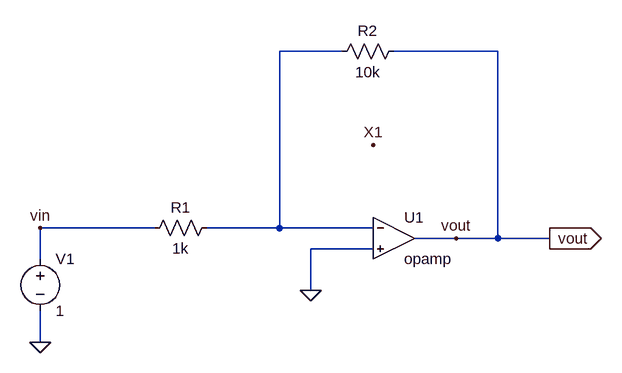
[diagram p0: schematic Practice Work 3.asc]
Practice Work 3.asc, the LTspice schematic file:
Version 4
SHEET 1 976 680
WIRE 544 -208 448 -208
WIRE 784 -208 624 -208
WIRE 256 64 80 64
WIRE 448 64 448 -208
WIRE 448 64 336 64
WIRE 592 64 448 64
WIRE 720 80 656 80
WIRE 784 80 784 -208
WIRE 784 80 720 80
WIRE 864 80 784 80
WIRE 592 96 496 96
WIRE 80 112 80 64
WIRE 496 160 496 96
WIRE 80 240 80 192
FLAG 80 240 0
FLAG 496 160 0
FLAG 80 64 vin
FLAG 720 80 vout
FLAG 864 80 vout
IOPIN 864 80 Out
FLAG 592 -64 X1
SYMBOL voltage 80 96 R0
WINDOW 123 0 0 Left 0
WINDOW 39 0 0 Left 0
SYMATTR InstName V1
SYMATTR Value 1
SYMBOL res 352 48 R90
WINDOW 0 0 56 VBottom 2
WINDOW 3 32 56 VTop 2
SYMATTR InstName R1
SYMATTR Value 1k
SYMBOL res 640 -224 R90
WINDOW 0 0 56 VBottom 2
WINDOW 3 32 56 VTop 2
SYMATTR InstName R2
SYMATTR Value 10k
SYMBOL OpAmps\\opamp 624 16 R0
SYMATTR InstName U1

The netlist it stands for:
* Practice Work 3.asc
V1 vin 0 1
R1 N001 vin 1k
R2 vout N001 10k
XU1 N001 0 vout opamp Aol=100K GBW=10Meg  ; pins invin noninvin out
.backanno
.end